# Altium schematic sheet TTD_SCHEMA.SchDoc
size A3; SheetNumber: 1; SheetTotal: 1
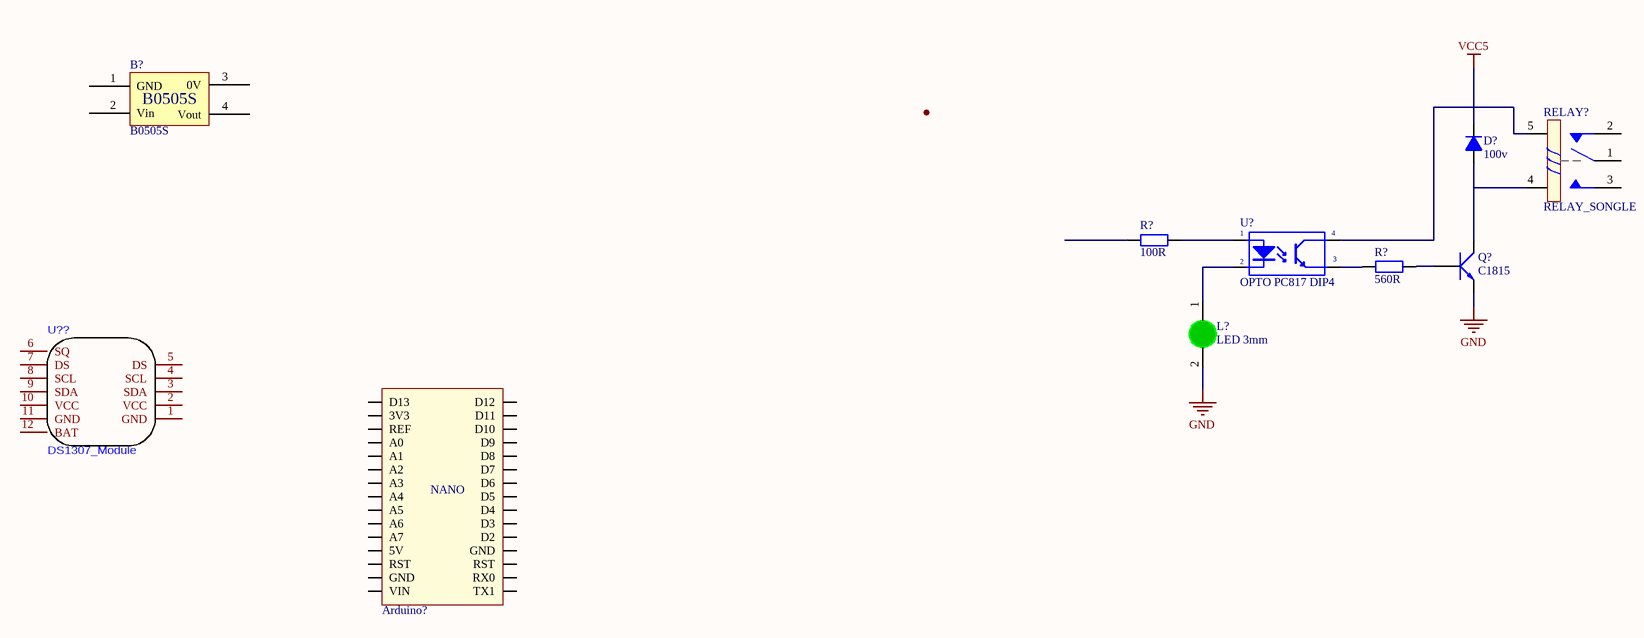
[diagram p0: TTD_SCHEMA.SchDoc]

## Parts
(Parts that share a designator on the sheet are numbered #1, #2 ... from top to bottom, then left to right.)
Arduino?  Arduino Nano  [Arduino Nano]  (value not drawn)
B?  B0505S  [B0505S]
D?  100v  [DIODE 0.5A]
L?  LED 3mm  [LED-3MM-GREEN]
Q?  C1815  [TO92]
R?#1  100R  [tro vach 1/4w]
R?#2  560R  [tro vach 1/2w]
RELAY?  RELAY_SONGLE  [RELAY_SONGLE]
U?  OPTO PC817 DIP4  [DIP4]
U??  DS1307_Module  [DS1307 MODULE]

## Nets
GND: L?.2(K) Q?.1(E)
VCC5: D?.2(K) RELAY?.5 U?.4(C)
NetD?_1: D?.1(A) Q?.2(C) RELAY?.4
NetL?_1: L?.1(A) U?.2(K)
NetQ?_3: Q?.3(B) R?#2.2
NetR?#1_2: R?#1.2 U?.1(A)
NetR?#2_1: R?#2.1 U?.3(E)

Not connected (* = marked no-connect by the designer): Arduino? 3V3 5V A0 A1 A2 A3 A4 A5 A6 A7 D2 D3 D4 D5 D6 D7 D8 D9 D10 D11 D12 D13 GND REF RST RX0 TX1 VIN; B? 1(GND) 2(Vin) 3(0V) 4(Vout); R?#1 1; RELAY? 1 2 3; U?? 1(GND) 2(VCC) 3(SDA) 4(SCL) 5(DS) 6(SQ) 7(DS) 8(SCL) 9(SDA) 10(VCC) 11(GND) 12(BAT)

## Notes on the sheet
- (in symbol Arduino Nano) NANO

## Library data of the parts
Arduino? = Arduino Nano: Value: Cau 1A
B? = B0505S: Cắm; Ten_Linh_Kien: B0505S-1W SIP4 IC Converter DC-DC; Don_Vi: Con; Ma_Hang: MH003143; Ghi_Chu: *; Kieu_Chan: *; Chung_Loai: Cắm
D? = Diode 1N4148: Cắm; Ten_Linh_Kien: Diode 1N4148 DO35 450mA 100V ( 1N4148 DIP); Don_Vi: Con; Ma_Hang: MH001065; Ghi Chu: *; Kieu_Chan: *; Chung_Loai: Cắm
L? = LED 3mm Xanh La: Cắm; Don_Vi: Con; Ma_Hang: MH001054; Ten_Linh_Kien: Led 3MM Phủ Xanh (10c); Ghi_Chu: *; Kieu_Chan: *; Chung_Loai: Cắm
Q? = C1815: NPN transistor; Value: C9014
R?#1 = Tro Vach 1/4W 5% 100R: Cắm; Don_Vi: Con; So_Chan: 2; Ten_Linh_Kien: Trở Vạch 1/4w 5% 100R; Ma_Hang: MH007353; Chung_Loai: Cắm; Kieu_Chan: *
R?#2 = Tro Vach 1/2W 5% 560R: Cắm; So_Chan: 2; Ten_Linh_Kien: Trở 5% 560R; Don_Vi: Con; Ma_Hang: MH006201; Chung_Loai: Cắm; Kieu_Chan: *
RELAY? = RELAY_SONGLE: RELAY SONGLE 5V
U? = OPTO PC817 DIP4: Single Opto; Value: PC817